# Altium schematic sheet SH02 - OMAP-L137 MCASP.SchDoc
size 386 x 246 mm
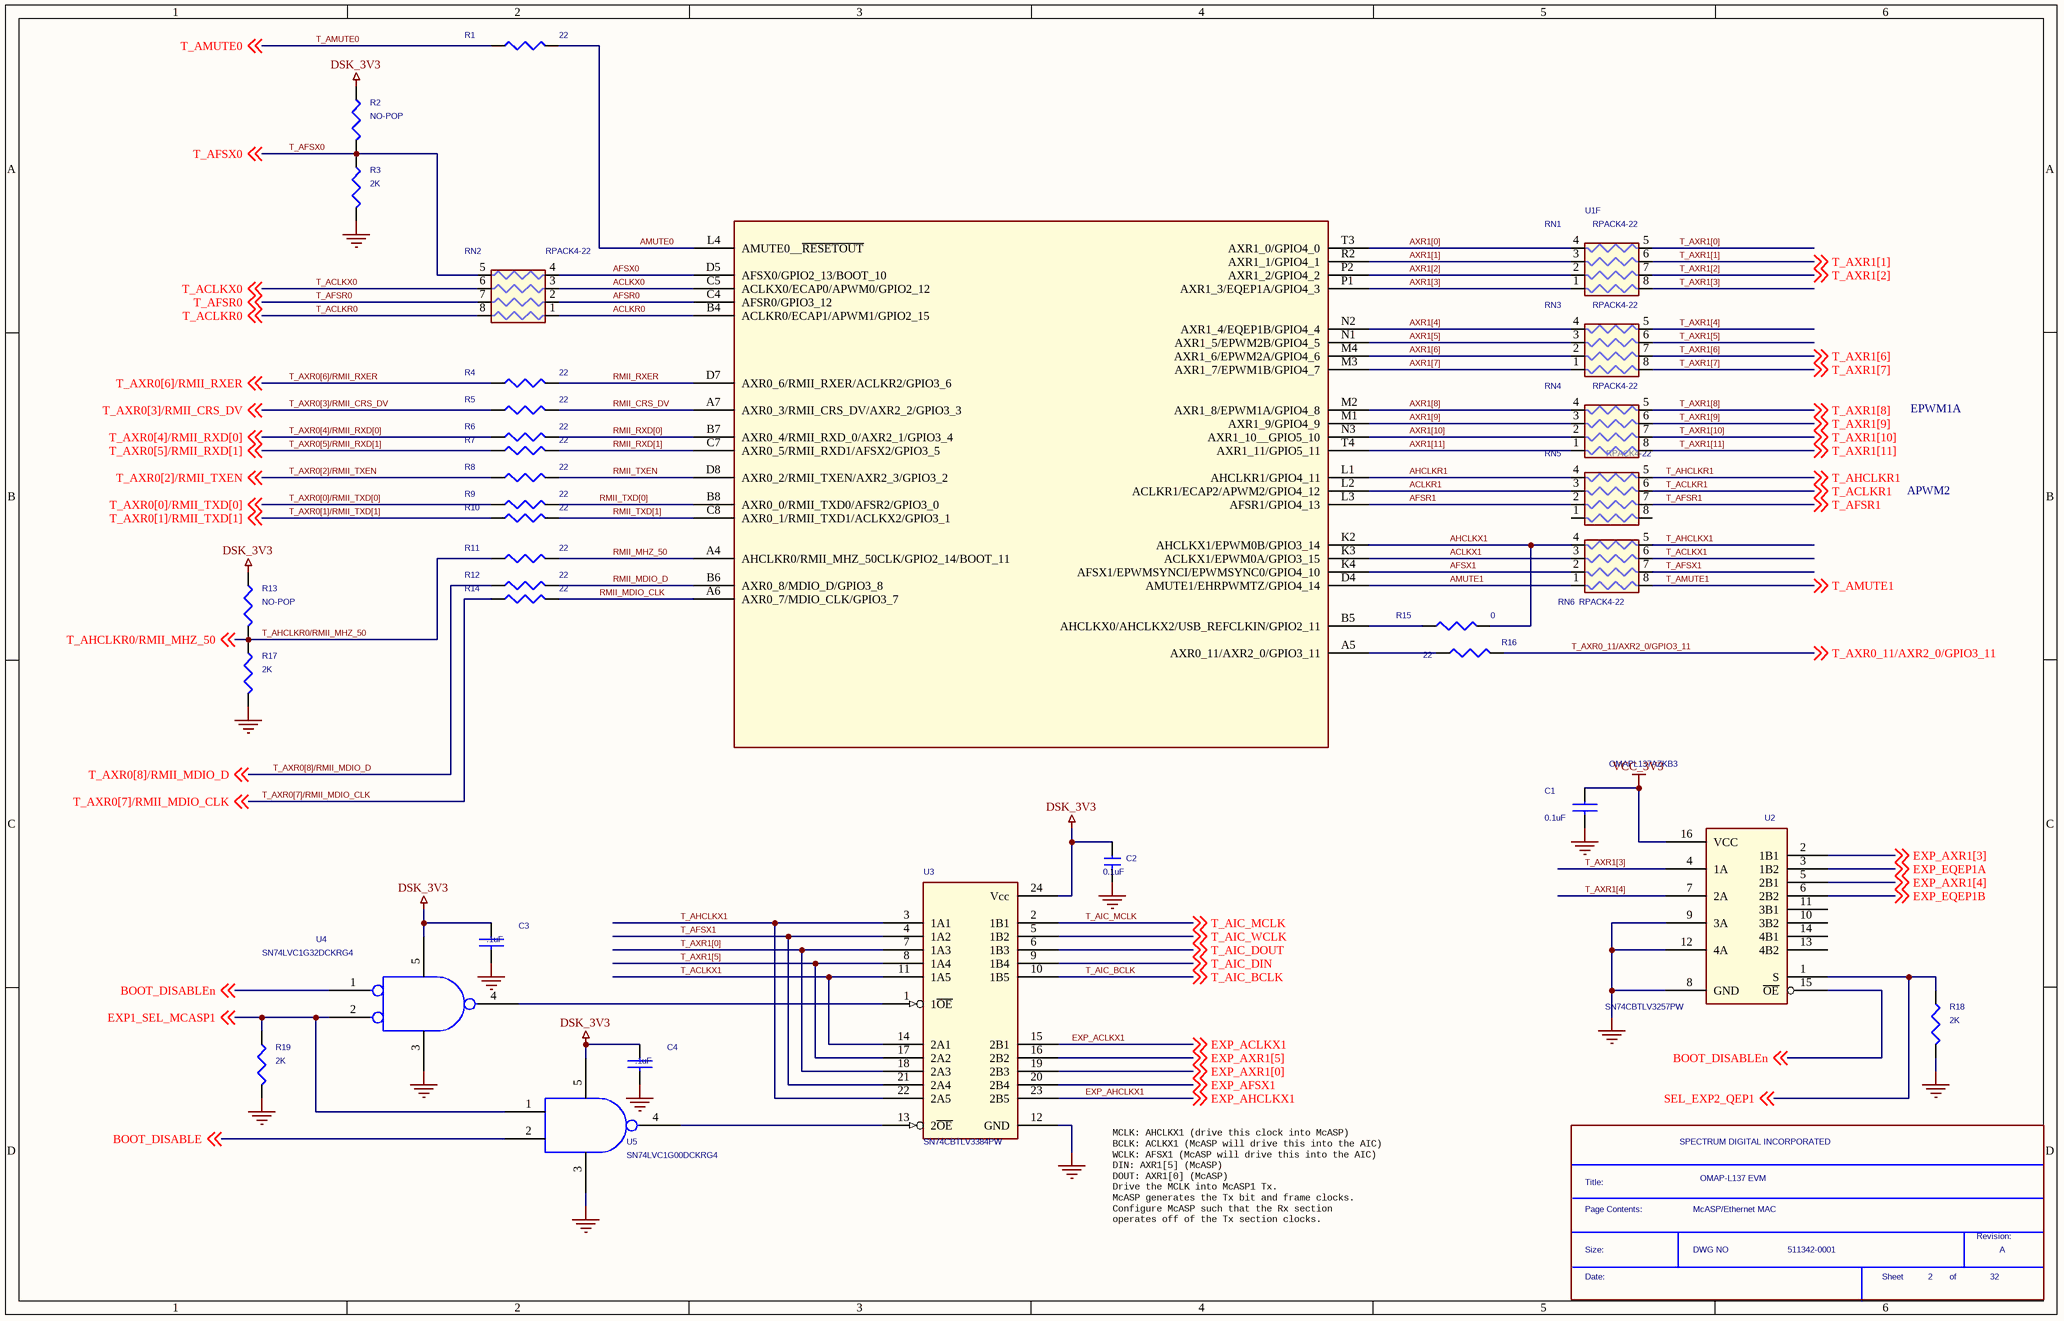
[diagram p0: SH02 - OMAP-L137 MCASP.SchDoc]

## Parts
*  Page Contents:: McASP/Ethernet MAC  RevCode: A  Title: OMAP-L137 EVM  OrgName: SPECTRUM DIGITAL INCORPORATED  Doc: 511342-0001  Page Number: 2  Page Count: 32  (hidden comment: SDTitleBlock)  (graphical)
C1  0.1uF  [c402-25]
C2  0.1uF  [c402-25]
C3  .1uF  [c402-25]
C4  .1uF  [c402-25]
R1  22  [r402-25]
R2  NO-POP  [r402-25]
R3  2K  [r402-25]
R4  22  [r402-25]
R5  22  [r402-25]
R6  22  [r402-25]
R7  22  [r402-25]
R8  22  [r402-25]
R9  22  [r402-25]
R10  22  [r402-25]
R11  22  [r402-25]
R12  22  [r402-25]
R13  NO-POP  [r402-25]
R14  22  [r402-25]
R15  0  [r402-25]
R16  22  [r402-25]
R17  2K  [r402-25]
R18  2K  [r402-25]
R19  2K  [r402-25]
RN1  RPACK4-22  [rpak8-10x25-28v]
RN2  RPACK4-22  [rpak8-10x25-28v]
RN3  RPACK4-22  [rpak8-10x25-28v]
RN4  RPACK4-22  [rpak8-10x25-28v]
RN5  RPACK4-22  [rpak8-10x25-28v]
RN6  RPACK4-22  [rpak8-10x25-28v]
U1  OMAPL137AZKB3  [skt256-6064]  (part F of 9)
U2  SN74CBTLV3257PW  [TSSOP-16]
U3  SN74CBTLV3384PW  [TSSOP-24]
U4  SN74LVC1G32DCKRG4  [dck-5]
U5  SN74LVC1G00DCKRG4  [dck-5]

## Nets
DSK_3V3: C2.1 C3.1 C4.1 R2.1 R13.1 U3.24(Vcc) U4.5(VCC) U5.5(VCC)
GND: C1.2 C2.2 C3.2 C4.2 R3.2 R17.2 R18.2 R19.2 U2.8(GND) U2.9(3A) U2.12(4A) U3.12(GND) U4.3(GND) U5.3(GND)
VCC_3V3: C1.1 U2.16(VCC)
ACLKR0: RN2.1(R1A) U1.B4(ACLKR0/ECAP1/APWM1/GPIO2_15)
ACLKR1: RN5.3(R3A) U1.L2(ACLKR1/ECAP2/APWM2/GPIO4_12)
ACLKX0: RN2.3(R3A) U1.C5(ACLKX0/ECAP0/APWM0/GPIO2_12)
ACLKX1: RN6.3(R3A) U1.K3(ACLKX1/EPWM0A/GPIO3_15)
AFSR0: RN2.2(R2A) U1.C4(AFSR0/GPIO3_12)
AFSR1: RN5.2(R2A) U1.L3(AFSR1/GPIO4_13)
AFSX0: RN2.4(R4A) U1.D5(AFSX0/GPIO2_13/BOOT_10)
AFSX1: RN6.2(R2A) U1.K4(AFSX1/EPWMSYNCI/EPWMSYNC0/GPIO4_10)
AHCLKR1: RN5.4(R4A) U1.L1(AHCLKR1/GPIO4_11)
AHCLKX1: R15.2 RN6.4(R4A) U1.K2(AHCLKX1/EPWM0B/GPIO3_14)
AMUTE0: R1.2 U1.L4(AMUTE0__~{RESETOUT})
AMUTE1: RN6.1(R1A) U1.D4(AMUTE1/EHRPWMTZ/GPIO4_14)
AXR1[0]: RN1.4(R4A) U1.T3(AXR1_0/GPIO4_0)
AXR1[1]: RN1.3(R3A) U1.R2(AXR1_1/GPIO4_1)
AXR1[2]: RN1.2(R2A) U1.P2(AXR1_2/GPIO4_2)
AXR1[3]: RN1.1(R1A) U1.P1(AXR1_3/EQEP1A/GPIO4_3)
AXR1[4]: RN3.4(R4A) U1.N2(AXR1_4/EQEP1B/GPIO4_4)
AXR1[5]: RN3.3(R3A) U1.N1(AXR1_5/EPWM2B/GPIO4_5)
AXR1[6]: RN3.2(R2A) U1.M4(AXR1_6/EPWM2A/GPIO4_6)
AXR1[7]: RN3.1(R1A) U1.M3(AXR1_7/EPWM1B/GPIO4_7)
AXR1[8]: RN4.4(R4A) U1.M2(AXR1_8/EPWM1A/GPIO4_8)
AXR1[9]: RN4.3(R3A) U1.M1(AXR1_9/GPIO4_9)
AXR1[10]: RN4.2(R2A) U1.N3(AXR1_10__GPIO5_10)
AXR1[11]: RN4.1(R1A) U1.T4(AXR1_11/GPIO5_11)
BOOT_DISABLE: U5.2(B) ; off-sheet BOOT_DISABLE
BOOT_DISABLEn: U2.15(~{OE}) U4.1(A) ; off-sheet BOOT_DISABLEn
EXP1_SEL_MCASP1: R19.1 U4.2(B) U5.1(A) ; off-sheet EXP1_SEL_MCASP1
EXP_ACLKX1: U3.15(2B1) ; off-sheet EXP_ACLKX1
EXP_AFSX1: U3.20(2B4) ; off-sheet EXP_AFSX1
EXP_AHCLKX1: U3.23(2B5) ; off-sheet EXP_AHCLKX1
EXP_AXR1[0]: U3.19(2B3) ; off-sheet EXP_AXR1[0]
EXP_AXR1[3]: U2.2(1B1) ; off-sheet EXP_AXR1[3]
EXP_AXR1[4]: U2.5(2B1) ; off-sheet EXP_AXR1[4]
EXP_AXR1[5]: U3.16(2B2) ; off-sheet EXP_AXR1[5]
EXP_EQEP1A: U2.3(1B2) ; off-sheet EXP_EQEP1A
EXP_EQEP1B: U2.6(2B2) ; off-sheet EXP_EQEP1B
RMII_CRS_DV: R5.2 U1.A7(AXR0_3/RMII_CRS_DV/AXR2_2/GPIO3_3)
RMII_MDIO_CLK: R14.2 U1.A6(AXR0_7/MDIO_CLK/GPIO3_7)
RMII_MDIO_D: R12.2 U1.B6(AXR0_8/MDIO_D/GPIO3_8)
RMII_MHZ_50: R11.2 U1.A4(AHCLKR0/RMII_MHZ_50CLK/GPIO2_14/BOOT_11)
RMII_RXD[0]: R6.2 U1.B7(AXR0_4/RMII_RXD_0/AXR2_1/GPIO3_4)
RMII_RXD[1]: R7.2 U1.C7(AXR0_5/RMII_RXD1/AFSX2/GPIO3_5)
RMII_RXER: R4.2 U1.D7(AXR0_6/RMII_RXER/ACLKR2/GPIO3_6)
RMII_TXD[0]: R9.2 U1.B8(AXR0_0/RMII_TXD0/AFSR2/GPIO3_0)
RMII_TXD[1]: R10.2 U1.C8(AXR0_1/RMII_TXD1/ACLKX2/GPIO3_1)
RMII_TXEN: R8.2 U1.D8(AXR0_2/RMII_TXEN/AXR2_3/GPIO3_2)
SEL_EXP2_QEP1: R18.1 U2.1(S) ; off-sheet SEL_EXP2_QEP1
T_ACLKR0: RN2.8(R1B) ; off-sheet T_ACLKR0
T_ACLKR1: RN5.6(R3B) ; off-sheet T_ACLKR1
T_ACLKX0: RN2.6(R3B) ; off-sheet T_ACLKX0
T_ACLKX1: RN6.6(R3B) U3.11(1A5) U3.14(2A1)
T_AFSR0: RN2.7(R2B) ; off-sheet T_AFSR0
T_AFSR1: RN5.7(R2B) ; off-sheet T_AFSR1
T_AFSX0: R2.2 R3.1 RN2.5(R4B) ; off-sheet T_AFSX0
T_AFSX1: RN6.7(R2B) U3.4(1A2) U3.21(2A4)
T_AHCLKR0/RMII_MHZ_50: R11.1 R13.2 R17.1 ; off-sheet T_AHCLKR0/RMII_MHZ_50
T_AHCLKR1: RN5.5(R4B) ; off-sheet T_AHCLKR1
T_AHCLKX1: RN6.5(R4B) U3.3(1A1) U3.22(2A5)
T_AIC_BCLK: U3.10(1B5) ; off-sheet T_AIC_BCLK
T_AIC_DIN: U3.9(1B4) ; off-sheet T_AIC_DIN
T_AIC_DOUT: U3.6(1B3) ; off-sheet T_AIC_DOUT
T_AIC_MCLK: U3.2(1B1) ; off-sheet T_AIC_MCLK
T_AIC_WCLK: U3.5(1B2) ; off-sheet T_AIC_WCLK
T_AMUTE0: R1.1 ; off-sheet T_AMUTE0
T_AMUTE1: RN6.8(R1B) ; off-sheet T_AMUTE1
T_AXR0[0]/RMII_TXD[0]: R9.1 ; off-sheet T_AXR0[0]/RMII_TXD[0]
T_AXR0[1]/RMII_TXD[1]: R10.1 ; off-sheet T_AXR0[1]/RMII_TXD[1]
T_AXR0[2]/RMII_TXEN: R8.1 ; off-sheet T_AXR0[2]/RMII_TXEN
T_AXR0[3]/RMII_CRS_DV: R5.1 ; off-sheet T_AXR0[3]/RMII_CRS_DV
T_AXR0[4]/RMII_RXD[0]: R6.1 ; off-sheet T_AXR0[4]/RMII_RXD[0]
T_AXR0[5]/RMII_RXD[1]: R7.1 ; off-sheet T_AXR0[5]/RMII_RXD[1]
T_AXR0[6]/RMII_RXER: R4.1 ; off-sheet T_AXR0[6]/RMII_RXER
T_AXR0[7]/RMII_MDIO_CLK: R14.1 ; off-sheet T_AXR0[7]/RMII_MDIO_CLK
T_AXR0[8]/RMII_MDIO_D: R12.1 ; off-sheet T_AXR0[8]/RMII_MDIO_D
T_AXR0_11/AXR2_0/GPIO3_11: R16.1 ; off-sheet T_AXR0_11/AXR2_0/GPIO3_11
T_AXR1[0]: RN1.5(R4B) U3.7(1A3) U3.18(2A3)
T_AXR1[1]: RN1.6(R3B) ; off-sheet T_AXR1[1]
T_AXR1[2]: RN1.7(R2B) ; off-sheet T_AXR1[2]
T_AXR1[3]: RN1.8(R1B) U2.4(1A)
T_AXR1[4]: RN3.5(R4B) U2.7(2A)
T_AXR1[5]: RN3.6(R3B) U3.8(1A4) U3.17(2A2)
T_AXR1[6]: RN3.7(R2B) ; off-sheet T_AXR1[6]
T_AXR1[7]: RN3.8(R1B) ; off-sheet T_AXR1[7]
T_AXR1[8]: RN4.5(R4B) ; off-sheet T_AXR1[8]
T_AXR1[9]: RN4.6(R3B) ; off-sheet T_AXR1[9]
T_AXR1[10]: RN4.7(R2B) ; off-sheet T_AXR1[10]
T_AXR1[11]: RN4.8(R1B) ; off-sheet T_AXR1[11]
NetR15_1: R15.1 U1.B5(AHCLKX0/AHCLKX2/USB_REFCLKIN/GPIO2_11)
NetR16_2: R16.2 U1.A5(AXR0_11/AXR2_0/GPIO3_11)
NetU3_1: U3.1(1~{OE}) U4.4(Y)
NetU3_13: U3.13(2~{OE}) U5.4(Y)

Not connected (* = marked no-connect by the designer): RN5 1(R1A) 8(R1B); U2 10(3B2) 11(3B1) 13(4B2) 14(4B1)

## Notes on the sheet
- EPWM1A
- APWM2
- (near *) MCLK: AHCLKX1 (drive this clock into McASP)
  BCLK: ACLKX1 (McASP will drive this into the AIC)
  WCLK: AFSX1 (McASP will drive this into the AIC)
  DIN: AXR1[5] (McASP)
  DOUT: AXR1[0] (McASP)
  Drive the MCLK into McASP1 Tx.
  McASP generates the Tx bit and frame clocks.
  Configure McASP such that the Rx section
  operates off of the Tx section clocks.
- (in symbol SDTitleBlock) Title:; Page Contents:; Revision:; Size:; DWG NO; Date:; Sheet; of

## Library data of the parts
C1 = CAP NP: Part #: 101587-1100R
C2 = CAP NP_1: Part #: 101587-1100R
C3 C4 = CAP NP_2: Part #: 101587-1100R
R1 R4-R12 R14 R16 = R: Part #: 101370-2200R
R2 R13 = R_1: Part #: R0402-NOPOP
R3 R17 = R_1: Part #: 101370-2002R
R15 = R: Part #: 101370-0001R
R18 R19 = R: Part #: 101370-2002R
RN1-RN6 = R-Pak4_0: Part #: 101327-2200R
U1 = PRIMUS_BGA_1: Part #: 102772-0001; SWAP_INFO: (S1+S2+S3+S4+S5+S6+S7+S8+S9); SPLIT_INST: TRUE
U2 = SN74CBT3257PW: IC, Quad 2-1 Multiplexer; Part #: 101670-0001R; Mfg: TI
U3 = SN74CBTD3384PW: IC, Quad 2-to-1 Mux with Level Conversion; Part #: 101679-0001R; Mfg: TI
U4 = 1g32neg: Part #: 101057-0032R
U5 = 1g00_0: Part #: 101057-0001R